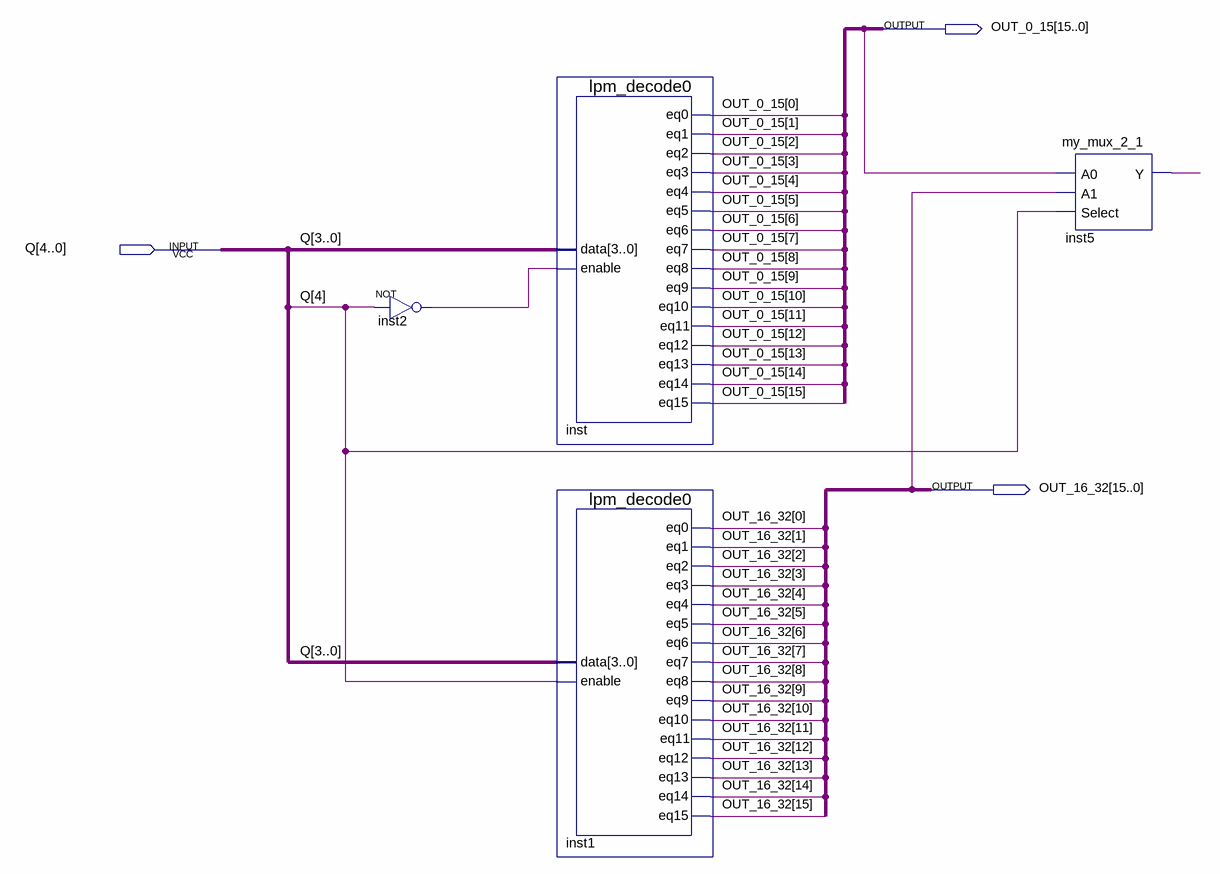
[diagram p0: schematic sheet]
// Quartus schematic dec_5_to_32.bdf as structural Verilog: 4 symbols, 3 pins
module dec_5_to_32 (
  input  [4:0] Q,
  output [15:0] OUT_0_15,
  output [15:0] OUT_16_32
);

  wire inst2_out, inst5_y, undriven, undriven_2;

  not inst2 (inst2_out, Q[4]);
  lpm_decode0 inst (
    .data(Q[3:0]), .enable(inst2_out), .eq0(OUT_0_15[0]), .eq1(OUT_0_15[1]), .eq2(OUT_0_15[2]),
    .eq3(OUT_0_15[3]), .eq4(OUT_0_15[4]), .eq5(OUT_0_15[5]), .eq6(OUT_0_15[6]), .eq7(OUT_0_15[7]),
    .eq8(OUT_0_15[8]), .eq9(OUT_0_15[9]), .eq10(OUT_0_15[10]), .eq11(OUT_0_15[11]), .eq12(OUT_0_15[12]),
    .eq13(OUT_0_15[13]), .eq14(OUT_0_15[14]), .eq15(OUT_0_15[15]));
  lpm_decode0 inst1 (
    .data(Q[3:0]), .enable(Q[4]), .eq0(OUT_16_32[0]), .eq1(OUT_16_32[1]), .eq2(OUT_16_32[2]),
    .eq3(OUT_16_32[3]), .eq4(OUT_16_32[4]), .eq5(OUT_16_32[5]), .eq6(OUT_16_32[6]), .eq7(OUT_16_32[7]),
    .eq8(OUT_16_32[8]), .eq9(OUT_16_32[9]), .eq10(OUT_16_32[10]), .eq11(OUT_16_32[11]), .eq12(OUT_16_32[12]),
    .eq13(OUT_16_32[13]), .eq14(OUT_16_32[14]), .eq15(OUT_16_32[15]));
  my_mux_2_1 inst5 (.A0(undriven_2), .A1(undriven), .Select(Q[4]), .Y(inst5_y));
endmodule
